# Altium schematic sheet SCH_switches.SchDoc
size A; SheetNumber: 3; SheetTotal: 3
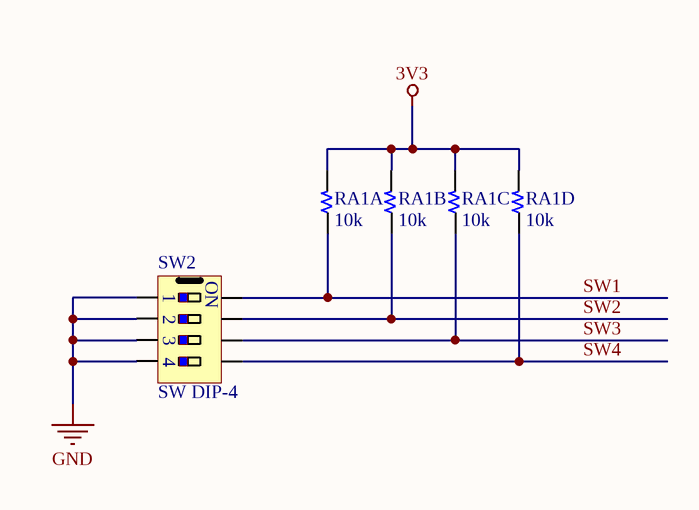
[diagram p0: SCH_switches.SchDoc]

## Parts
RA1A  10k  [R 0805]
RA1B  10k  [R 0805]
RA1C  10k  [R 0805]
RA1D  10k  [R 0805]
SW2  SW DIP-4  [SW/DIP4]

## Nets
3V3: RA1A.2 RA1B.2 RA1C.2 RA1D.2
GND: SW2.1 SW2.2 SW2.3 SW2.4
SW1: RA1A.1 SW2.8
SW2: RA1B.1 SW2.7
SW3: RA1C.1 SW2.6
SW4: RA1D.1 SW2.5

## Notes on the sheet
- (in symbol SW DIP-4) ON

## Library data of the parts
RA1A RA1B RA1C RA1D = Resistor